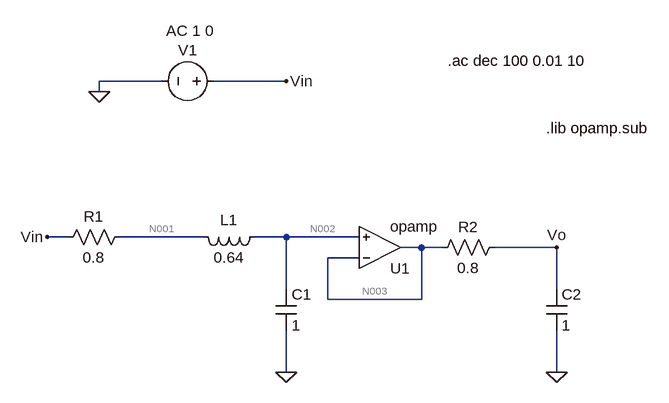
[diagram p0: schematic Circuito_Normalizado_Bien.asc]
Circuito_Normalizado_Bien.asc, the LTspice schematic file:
Version 4
SHEET 1 880 680
WIRE -160 -128 -256 -128
WIRE 32 -128 -80 -128
WIRE -256 -112 -256 -128
WIRE -304 112 -336 112
WIRE -96 112 -224 112
WIRE 32 112 -16 112
WIRE 144 112 32 112
WIRE 240 128 208 128
WIRE 272 128 240 128
WIRE 448 128 352 128
WIRE 144 144 96 144
WIRE 32 192 32 112
WIRE 448 192 448 128
WIRE 96 208 96 144
WIRE 240 208 240 128
WIRE 240 208 96 208
WIRE 32 320 32 256
WIRE 448 320 448 256
FLAG 32 320 0
FLAG 448 320 0
FLAG -336 112 Vin
FLAG 448 128 Vo
FLAG -256 -112 0
FLAG 32 -128 Vin
SYMBOL OpAmps\\opamp 176 192 M180
SYMATTR InstName U1
SYMBOL res -208 96 R90
WINDOW 0 0 56 VBottom 2
WINDOW 3 32 56 VTop 2
SYMATTR InstName R1
SYMATTR Value 0.8
SYMBOL res 368 112 R90
WINDOW 0 0 56 VBottom 2
WINDOW 3 32 56 VTop 2
SYMATTR InstName R2
SYMATTR Value 0.8
SYMBOL ind 0 96 R90
WINDOW 0 5 56 VBottom 2
WINDOW 3 32 56 VTop 2
SYMATTR InstName L1
SYMATTR Value 0.64
SYMBOL cap 16 192 R0
SYMATTR InstName C1
SYMATTR Value 1
SYMBOL cap 432 192 R0
SYMATTR InstName C2
SYMATTR Value 1
SYMBOL voltage -64 -128 R90
WINDOW 0 -32 56 VBottom 2
WINDOW 3 32 56 VTop 2
WINDOW 123 -62 52 VBottom 2
WINDOW 39 0 0 Left 0
SYMATTR InstName V1
SYMATTR Value ""
SYMATTR Value2 AC 1 0
TEXT 432 -56 Left 2 !.lib opamp.sub
TEXT 280 -160 Left 2 !.ac dec 100 0.01 10

The netlist it stands for:
* Circuito_Normalizado_Bien.asc
XU1 N003 N002 N003 opamp Aol=100K GBW=10Meg  ; pins invin noninvin out
R1 N001 Vin 0.8
R2 Vo N003 0.8
L1 N002 N001 0.64
C1 N002 0 1
C2 Vo 0 1
V1 Vin 0 AC 1 0
.lib opamp.sub
.ac dec 100 0.01 10
.backanno
.end

* Results of the author's LTspice run, read from the files saved beside the schematic
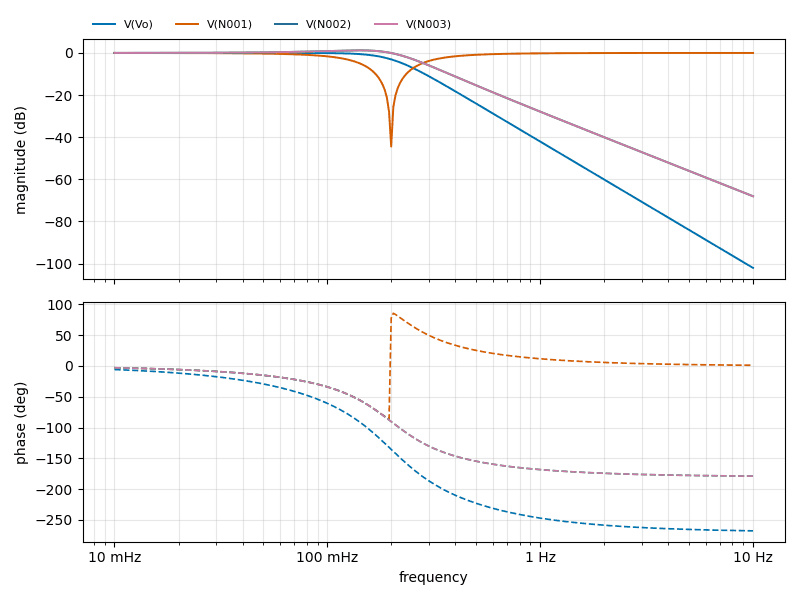
[diagram p1: AC Analysis of Circuito_Normalizado_Bien.asc, plotted from the saved traces]
* AC Analysis, 1 run:
*   V(Vo): -0.00 dB at 10 mHz, -102.08 dB at 10 Hz, peak -0.00 dB at 10 mHz, 3 dB below the peak at 198.8 mHz
*   V(N001): -0.01 dB at 10 mHz, -0.00 dB at 10 Hz, peak -0.00 dB at 10 Hz, 3 dB below the peak at 322.1 mHz
*   V(N002): 0.01 dB at 10 mHz, -68.05 dB at 10 Hz, peak 1.24 dB at 141.3 mHz, 3 dB below the peak at 232.4 mHz
*   V(N003): 0.01 dB at 10 mHz, -68.05 dB at 10 Hz, peak 1.24 dB at 141.3 mHz, 3 dB below the peak at 232.4 mHz